# Altium schematic sheet Block Diagram.SchDoc: Block diagram
size A4; Engineer: Naif Aljophani; DocumentNumber: 1; Revision: V1.0; SheetNumber: 1; SheetTotal: 8
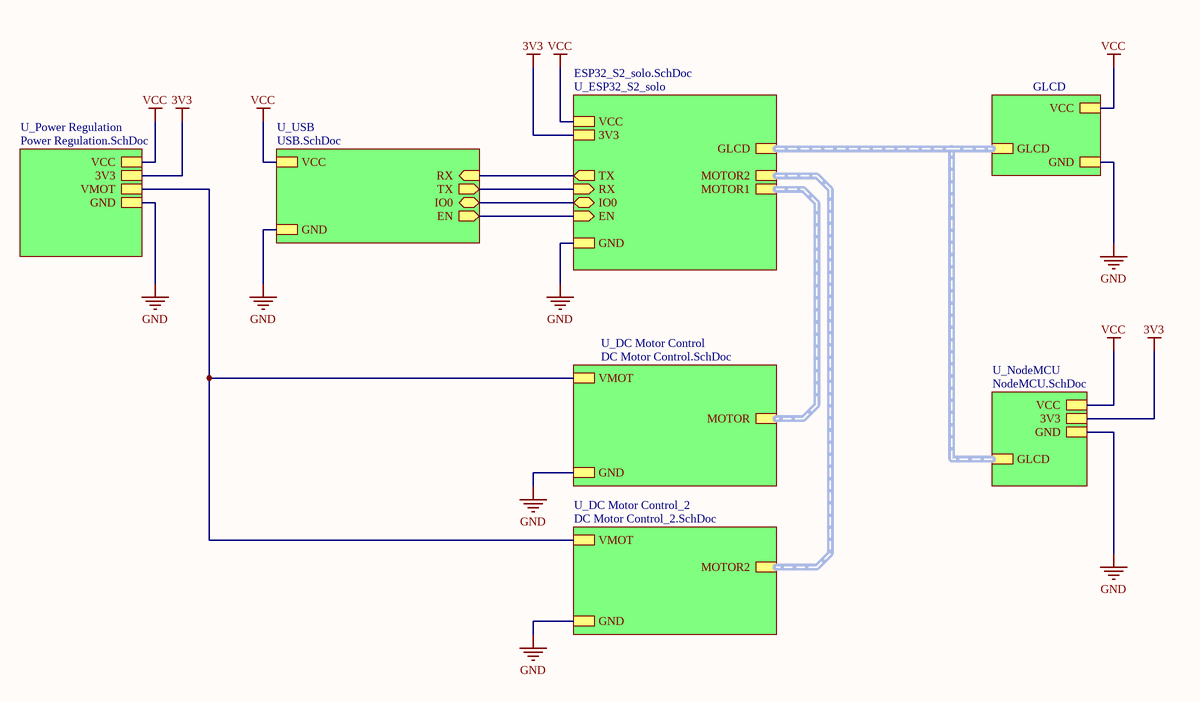
[diagram p0: Block Diagram.SchDoc]

## Sub-sheets
GLCD = GLCD.SchDoc: VCC, GND, GLCD (harness GLCD)
U_DC Motor Control = DC Motor Control.SchDoc: VMOT, GND, MOTOR (harness MOTOR)
U_DC Motor Control_2 = DC Motor Control_2.SchDoc: VMOT, GND, MOTOR2 (harness MOTOR)
U_ESP32_S2_solo = ESP32_S2_solo.SchDoc: 3V3, GND, VCC, IO0 (bidir), EN (in), TX (out), RX (in), GLCD (harness GLCD), MOTOR2 (harness MOTOR), MOTOR1 (harness MOTOR)
U_NodeMCU = NodeMCU.SchDoc: VCC, 3V3, GND, GLCD (harness GLCD)
U_Power Regulation = Power Regulation.SchDoc: 3V3, GND, VCC, VMOT
U_USB = USB.SchDoc: GND, EN (out), IO0 (bidir), VCC, RX (in), TX (out)

## Nets
3V3: sheet U_ESP32_S2_solo/3V3, sheet U_NodeMCU/3V3, sheet U_Power Regulation/3V3
GND: sheet GLCD/GND, sheet U_ESP32_S2_solo/GND, sheet U_DC Motor Control/GND, sheet U_NodeMCU/GND, sheet U_Power Regulation/GND, sheet U_USB/GND, sheet U_DC Motor Control_2/GND
VCC: sheet GLCD/VCC, sheet U_ESP32_S2_solo/VCC, sheet U_NodeMCU/VCC, sheet U_Power Regulation/VCC, sheet U_USB/VCC
(unnamed): sheet U_ESP32_S2_solo/IO0, sheet U_USB/IO0
(unnamed): sheet U_ESP32_S2_solo/EN, sheet U_USB/EN
(unnamed): sheet U_ESP32_S2_solo/TX, sheet U_USB/RX
(unnamed): sheet U_ESP32_S2_solo/RX, sheet U_USB/TX
(unnamed): sheet U_DC Motor Control/VMOT, sheet U_Power Regulation/VMOT, sheet U_DC Motor Control_2/VMOT

## Buses and harness runs
harness sheet GLCD/GLCD = sheet U_ESP32_S2_solo/GLCD = sheet U_NodeMCU/GLCD
harness sheet U_DC Motor Control/MOTOR = sheet U_ESP32_S2_solo/MOTOR1
harness sheet U_DC Motor Control_2/MOTOR2 = sheet U_ESP32_S2_solo/MOTOR2